# EAGLE design Motor_Driver_v4 (EAGLE 7.2.0)
DATABASE: C:\EAGLE-7.2.0\ulp\bom-ex164
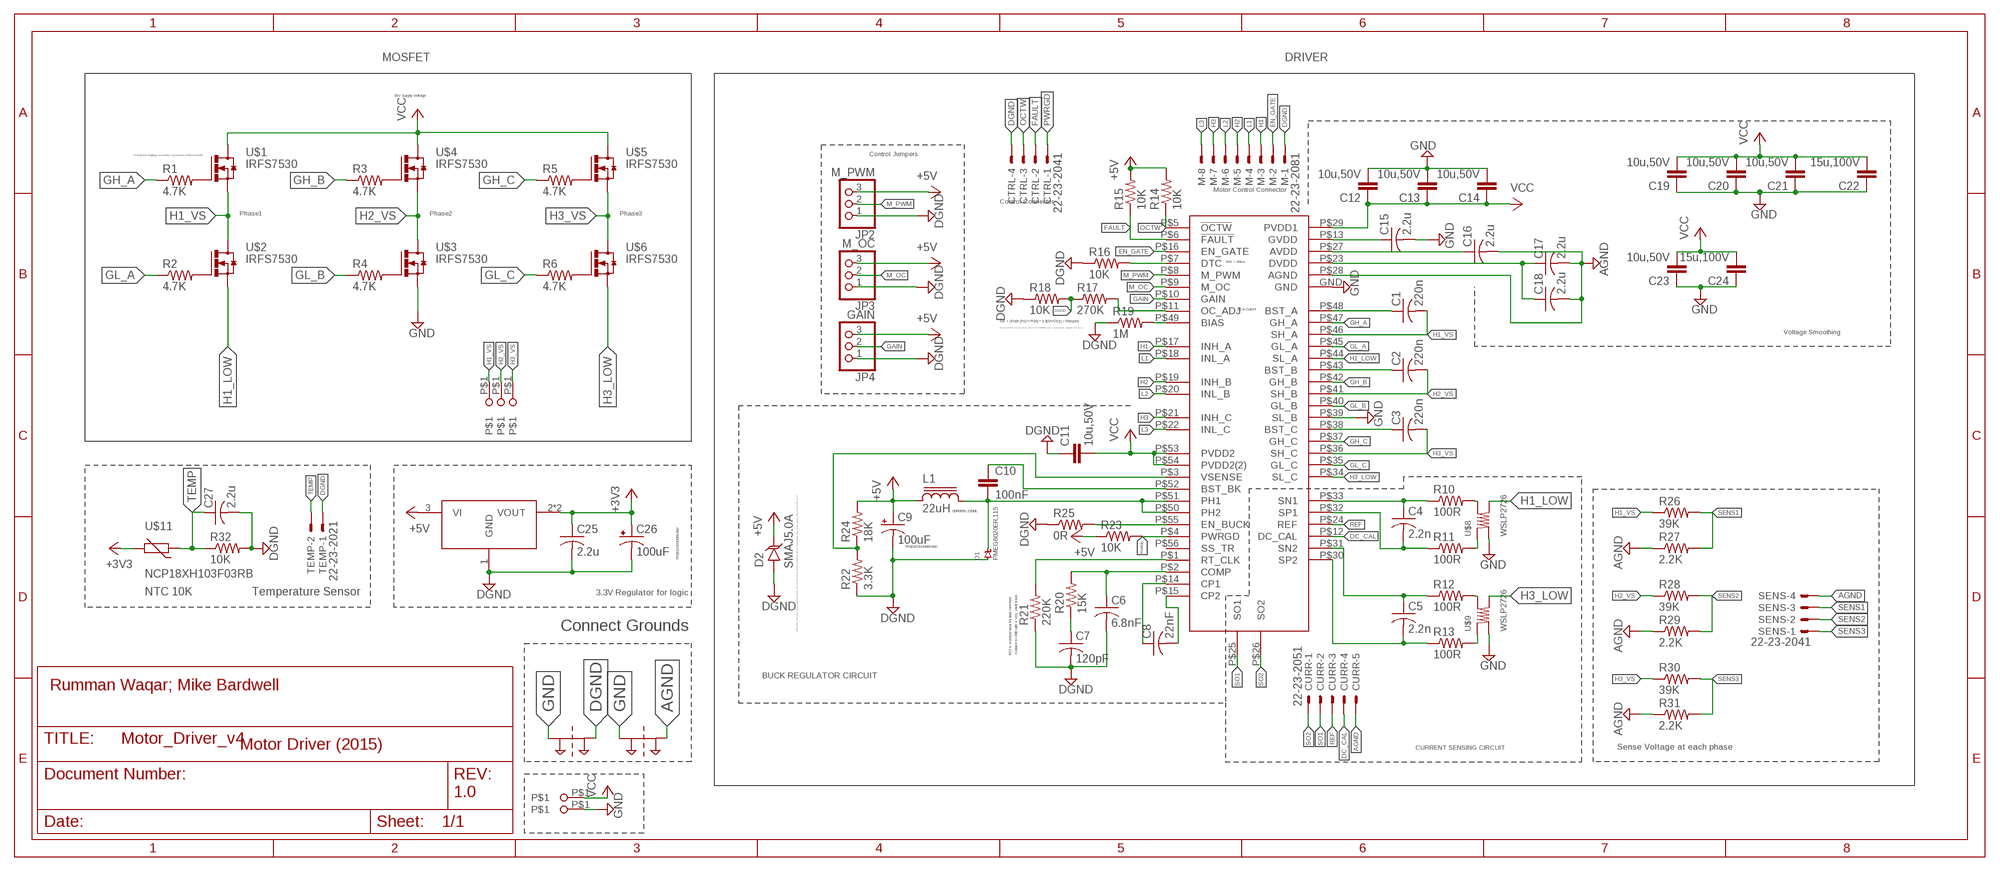
[diagram p0: schematic, sheet 1]

## Parts
C1  220n  C-USC0805  [C0805]
C2  220n  C-USC0805  [C0805]
C3  220n  C-USC0805  [C0805]
C4  2.2n  C-USC0603  [C0603]
C5  2.2n  C-USC0603  [C0603]
C6  6.8nF  C-USC0603  [C0603]
C7  120pF  C-USC0603  [C0603]
C8  22nF  C-USC0603  [C0603]
C9  100uF  CAP_POL3528-KIT  [EIA3528-KIT]
C10  100nF  CAP0805  [0805]
C11  10u,50V  CAP1206  [1206]
C12  10u,50V  CAP1206  [1206]
C13  10u,50V  CAP1206  [1206]
C14  10u,50V  CAP1206  [1206]
C15  2.2u  C-USC0805  [C0805]
C16  2.2u  C-USC0805  [C0805]
C17  2.2u  C-USC0805  [C0805]
C18  2.2u  C-USC0805  [C0805]
C19  10u,50V  CAP1206  [1206]
C20  10u,50V  CAP1206  [1206]
C21  10u,50V  CAP1206  [1206]
C22  15u,100V  C-EUC2220K  [C2220K]
C23  10u,50V  CAP1206  [1206]
C24  15u,100V  C-EUC2220K  [C2220K]
C25  2.2u  C-USC0805  [C0805]
C26  100uF  CAP_POL3528-KIT  [EIA3528-KIT]
C27  2.2u  C-USC0805  [C0805]
CTRL  22-23-2041  [22-23-2041]
CURR  22-23-2051  [22-23-2051]
D1  PMEG6020ER,115  DIODE[SCHOTKY]-SOD123W  [SOD123W]
D2  SMAJ5.0A  TVSSMA  [SMA-DIODE]
JP2  M_PWM  PINHD-1X3  [1X03]
JP3  M_OC  PINHD-1X3  [1X03]
JP4  GAIN  PINHD-1X3  [1X03]
L1  22uH  SDR0805  [SDR0805]
M  22-23-2081  [22-23-2081]
PT1  2PT_GND_TIE  [2PT_GND_TIE]
PT2  2PT_GND_TIE  [2PT_GND_TIE]
R1  4.7K  R-US_R0603  [R0603]
R2  4.7K  R-US_R0603  [R0603]
R3  4.7K  R-US_R0603  [R0603]
R4  4.7K  R-US_R0603  [R0603]
R5  4.7K  R-US_R0603  [R0603]
R6  4.7K  R-US_R0603  [R0603]
R10  100R  R-US_R0603  [R0603]
R11  100R  R-US_R0603  [R0603]
R12  100R  R-US_R0603  [R0603]
R13  100R  R-US_R0603  [R0603]
R14  10K  R-US_R0603  [R0603]
R15  10K  R-US_R0603  [R0603]
R16  10K  R-US_R0603  [R0603]
R17  270K  R-US_R0603  [R0603]
R18  10K  R-US_R0603  [R0603]
R19  1M  R-US_R0603  [R0603]
R20  15K  R-US_R0603  [R0603]
R21  220K  R-US_R0603  [R0603]
R22  3.3K  R-US_R0603  [R0603]
R23  10K  R-US_R0603  [R0603]
R24  18K  R-US_R0603  [R0603]
R25  0R  R-US_R0603  [R0603]
R26  39K  R-US_R0805  [R0805]
R27  2.2K  R-US_R0805  [R0805]
R28  39K  R-US_R0805  [R0805]
R29  2.2K  R-US_R0805  [R0805]
R30  39K  R-US_R0805  [R0805]
R31  2.2K  R-US_R0805  [R0805]
R32  10K  R-US_M0805  [M0805]
SENS  22-23-2041  [22-23-2041]
TEMP  22-23-2021  [22-23-2021]
U$1  IRFS7530  IRFS7530_HEATSINK  [IRF7530_HEATSINK]
U$2  IRFS7530  IRFS7530_HEATSINK  [IRF7530_HEATSINK]
U$3  IRFS7530  IRFS7530_HEATSINK  [IRF7530_HEATSINK]
U$4  IRFS7530  IRFS7530_HEATSINK  [IRF7530_HEATSINK]
U$5  IRFS7530  IRFS7530_HEATSINK  [IRF7530_HEATSINK]
U$6  IRFS7530  IRFS7530_HEATSINK  [IRF7530_HEATSINK]
U$7  DRV8302  [DRV8302]
U$8  WSLP2726  [WSLP2726]
U$9  WSLP2726  [WSLP2726]
U$10  TC2117  [SOT223]
U$11  NCP18XH103F03RB  [R0603]
U$12  1CONN_SOLDER  [1CONN_PAD]
U$13  1CONN_SOLDER  [1CONN_PAD]
U$14  1CONN_SOLDER  [1CONN_PAD]
U$15  1CONN_SOLDER  [1CONN_PAD]
U$16  1CONN_SOLDER  [1CONN_PAD]

## Nets
+3V3: C25.1 C26.A(+) U$10.2(VOUT) U$10.4(VOUT) U$11.2
+5V: C9.A(+) D2.C JP2.3 JP3.3 JP4.3 L1.1 R14.2 R15.2 R23.1 R24.2 U$10.3(VI)
AGND: C16.2 C17.2 C18.2 CURR.5 PT2.P$2 R27.1 R29.1 R31.1 SENS.4 U$7.P$28(AGND)
DC_CAL: CURR.4 U$7.P$12(DC_CAL)
DGND: C6.2 C7.2 C9.C(-) C11.1 C25.2 C26.C(-) C27.2 CTRL.4 D1.P$1 D2.A JP2.1 JP3.1 JP4.1 M.1 PT1.P$2 R16.1 R18.1 R19.1 R21.1 R22.1 R25.1 R32.2 TEMP.1 U$10.1(GND)
DVDD: R17.1 R18.2
EN_GATE: M.2 U$7.P$16(EN_GATE)
FAULT: CTRL.2 R15.1 U$7.P$6(!FAULT)
GAIN: JP4.2 U$7.P$10(GAIN)
GH_A: R1.1 U$7.P$47(GH_A)
GH_B: R3.1 U$7.P$42(GH_B)
GH_C: R5.1 U$7.P$37(GH_C)
GL_A: R2.1 U$7.P$45(GL_A)
GL_B: R4.1 U$7.P$40(GL_B)
GL_C: R6.1 U$7.P$35(GL_C)
GND: C12.2 C13.2 C14.2 C15.2 C19.1 C20.1 C21.1 C22.1 C23.1 C24.1 PT1.P$1 PT2.P$1 U$3.S1(S) U$3.S2(S) U$3.S3(S) U$3.S4(S) U$3.S5(S) U$7.GND U$7.P$39(SL_B) U$8.P$2 U$9.P$2 U$16.P$1
H1: M.3 U$7.P$17(INH_A)
H1_LOW: U$2.S1(S) U$2.S2(S) U$2.S3(S) U$2.S4(S) U$2.S5(S) U$7.P$44(SL_A) U$8.P$1
H1_VS: C1.2 R26.1 U$1.S1(S) U$1.S2(S) U$1.S3(S) U$1.S4(S) U$1.S5(S) U$2.D1(D) U$7.P$46(SH_A) U$14.P$1
H2: M.5 U$7.P$19(INH_B)
H2_VS: C2.2 R28.1 U$3.D1(D) U$4.S1(S) U$4.S2(S) U$4.S3(S) U$4.S4(S) U$4.S5(S) U$7.P$41(SH_B) U$13.P$1
H3: M.7 U$7.P$21(INH_C)
H3_LOW: U$6.S1(S) U$6.S2(S) U$6.S3(S) U$6.S4(S) U$6.S5(S) U$7.P$34(SL_C) U$9.P$1
H3_VS: C3.2 R30.1 U$5.S1(S) U$5.S2(S) U$5.S3(S) U$5.S4(S) U$5.S5(S) U$6.D1(D) U$7.P$36(SH_C) U$12.P$1
L1: M.4 U$7.P$18(INL_A)
L2: M.6 U$7.P$20(INL_B)
L3: M.8 U$7.P$22(INL_C)
M_OC: JP3.2 U$7.P$9(M_OC)
M_PWM: JP2.2 U$7.P$8(M_PWM)
N$1: R1.2 U$1.G1(G)
N$2: R2.2 U$2.G1(G)
N$3: R4.2 U$3.G1(G)
N$4: R3.2 U$4.G1(G)
N$5: R5.2 U$5.G1(G)
N$6: R6.2 U$6.G1(G)
N$7: C1.1 U$7.P$48(BST_A)
N$8: R17.2 U$7.P$11(OC_ADJ)
N$10: C8.1 U$7.P$14(CP1)
N$11: C5.2 R13.1 U$7.P$30(SP2)
N$12: C2.1 U$7.P$43(BST_B)
N$13: C8.2 U$7.P$15(CP2)
N$14: C7.1 R20.1
N$15: R21.2 U$7.P$1(RT_CLK)
N$16: R16.2 U$7.P$7(DTC)
N$17: R25.2 U$7.P$55(EN_BUCK)
N$18: C15.1 U$7.P$13(GVDD)
N$19: C10.2 D1.P$2 L1.2 U$7.P$50(PH2) U$7.P$51(PH1)
N$20: C6.1 R20.2 U$7.P$2(COMP)
N$21: R19.2 U$7.P$49(BIAS)
N$22: C4.1 R10.1 U$7.P$33(SN1)
N$23: C4.2 R11.1 U$7.P$32(SP1)
N$24: C5.1 R12.1 U$7.P$31(SN2)
N$26: C3.1 U$7.P$38(BST_C)
N$27: C16.1 U$7.P$27(AVDD)
N$28: R22.2 R24.1 U$7.P$3(VSENSE)
N$29: C10.1 U$7.P$52(BST_BK)
N$30: C17.1 C18.1 U$7.P$23(DVDD)
N$124: R12.2 U$9.P$3
N$126: R10.2 U$8.P$3
N$127: R11.2 U$8.P$4
N$128: R13.2 U$9.P$4
OCTW: CTRL.3 R14.1 U$7.P$5(!OCTW)
PWRGD: CTRL.1 R23.2 U$7.P$4(PWRGD)
REF: CURR.3 U$7.P$24(REF)
SENS1: R26.2 R27.2 SENS.3
SENS2: R28.2 R29.2 SENS.2
SENS3: R30.2 R31.2 SENS.1
SO1: CURR.2 U$7.P$25(SO1)
SO2: CURR.1 U$7.P$26(SO2)
TEMP: C27.1 R32.1 TEMP.2 U$11.1
VCC: C11.2 C12.1 C13.1 C14.1 C19.2 C20.2 C21.2 C22.2 C23.2 C24.2 U$1.D1(D) U$4.D1(D) U$5.D1(D) U$7.P$29(PVDD1) U$7.P$53(PVDD2) U$7.P$54(PVDD2(2)) U$15.P$1
Unconnected: U$7.P$56(SS_TR)

## Notes on the sheet
- MOSFET | DRIVER
- 36V Supply Voltage
- * Dampens ringing caused by capacitance of the mosfet | Control Jumpers
- Motor Control Connector
- Control Connector
- Phase1 | Phase2 | Phase3
- 10K = 80ns
- 90 A Cutoff
- Ioc = (R18/ (R17+R18) * 3.3[DVDD] ) / Rds(on)
- Don't mount R18, because internal current limit of DRV8302 doesn't work with this config for some reason
- Voltage Smoothing
- SDR0805-220ML
- TPSB107K006R0400
- TPSB107K006R0400
- NTC 10K | Temperature Sensor | 3.3V Regulator for logic
- Connect Grounds | A TVS diode, or transient voltage suppression diode, is an electrical device which is designed to divert or shunt voltage spikes from a circuit in order to protect that circuit.
- R21 is external clock for buck converter. | Connect to GND with a very short trace.
- BUCK REGULATOR CIRCUIT
- Rumman Waqar; Mike Bardwell
- Motor Driver (2015) | CURRENT SENSING CIRCUIT | Sense Voltage at each phase
- 1.0

## Library data of the parts
C1-C8 C15-C18 C25 C27 = adafruit:C-US: CAPACITOR, American symbol
C9 C26 = SparkFun-Capacitors:CAP_POL: Capacitor Polarized These are standard SMD and PTH capacitors. Normally 10uF, 47uF, and 100uF in electrolytic and tantalum varieties. Always verify the external diameter of the through hole cap, it varies with capacity, voltage, and manufacturer. The EIA devices should be standard.
C10-C14 C19-C21 C23 = SparkFun-Passives:CAP: Capacitor Standard 0603 ceramic capacitor, and 0.1" leaded capacitor.
C22 C24 = resistor:C-EU: CAPACITOR, European symbol
CTRL SENS = con-molex:22-23-2041: .100" (2.54mm) Center Header - 4 Pin; MF: MOLEX; MPN: 22-23-2041; OC_FARNELL: 1462920; OC_NEWARK: 38C0355
CURR = con-molex:22-23-2051: .100" (2.54mm) Center Header - 5 Pin; MF: MOLEX; MPN: 22-23-2051; OC_FARNELL: 1462952; OC_NEWARK: 38C9178
D1 = nxp:DIODE[SCHOTKY]
D2 = SparkFun-DiscreteSemi:TVS: Transient voltage suppressor- prevents ESD on inputs.
JP2-JP4 = pinhead:PINHD-1X3: PIN HEADER
L1 = bourne:SDR0805: POWER INDUCTOR
M = con-molex:22-23-2081: .100" (2.54mm) Center Header - 8 Pin; MF: MOLEX; MPN: 22-23-2081; OC_FARNELL: 1756826; OC_NEWARK: 01C7592
PT1 PT2 = SparkFun-Passives:2PT_GND_TIE: Package for connecting two ground nets in one place.
R1-R6 R10-R32 = adafruit:R-US_: RESISTOR, American symbol
TEMP = con-molex:22-23-2021: .100" (2.54mm) Center Header - 2 Pin; MF: MOLEX; MPN: 22-23-2021; OC_FARNELL: 1462926; OC_NEWARK: 25C3832
U$1-U$6 = bldc_lib:IRFS7530_HEATSINK: IRFS7530 with Heatsink
U$7 = bldc_lib:DRV8302: DRV8302 3-Phase Brushless Motor Pre-Driver with Dual Current Sense Amps and Buck Converter (PWM Ctrl)
U$8 U$9 = bldc_lib:WSLP2726: WSLP2726 Power Metal Strip® Resistors, Very High Power (to 7 W), Low Value (down to 0.0003 ), Surface Mount
U$10 = bldc_lib:TC2117
U$11 = bldc_lib:NCP18XH103F03RB: NTC Thermistor NTC Thermistors 10K OHM 1%
U$12-U$16 = bldc_lib:1CONN_SOLDER

## Board
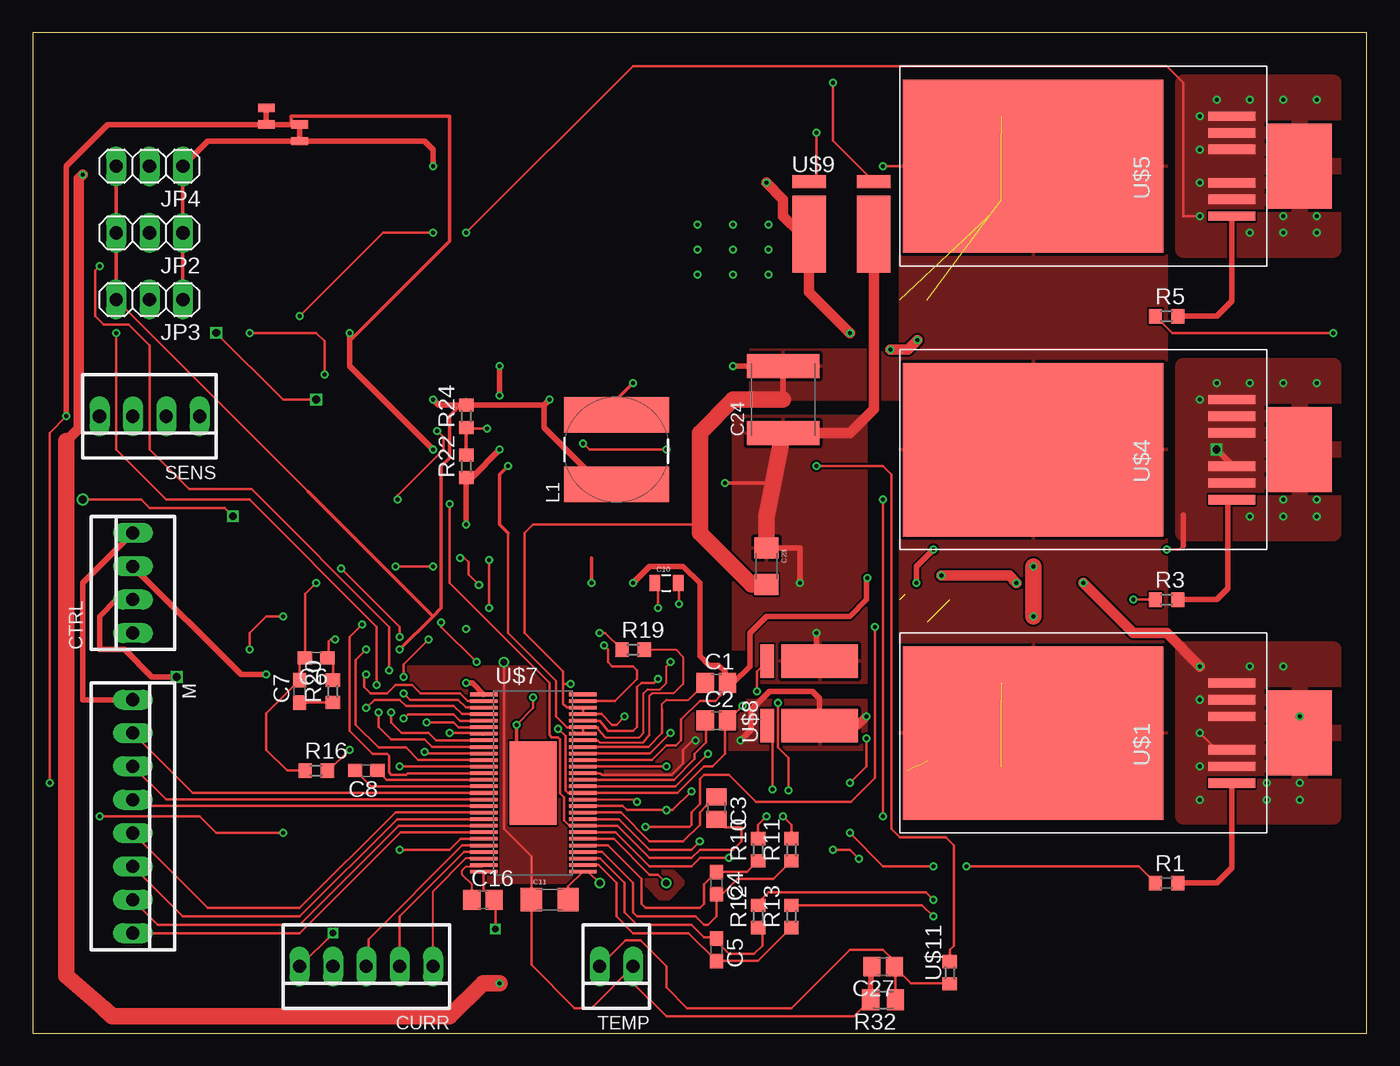
[diagram p1: board, top side]
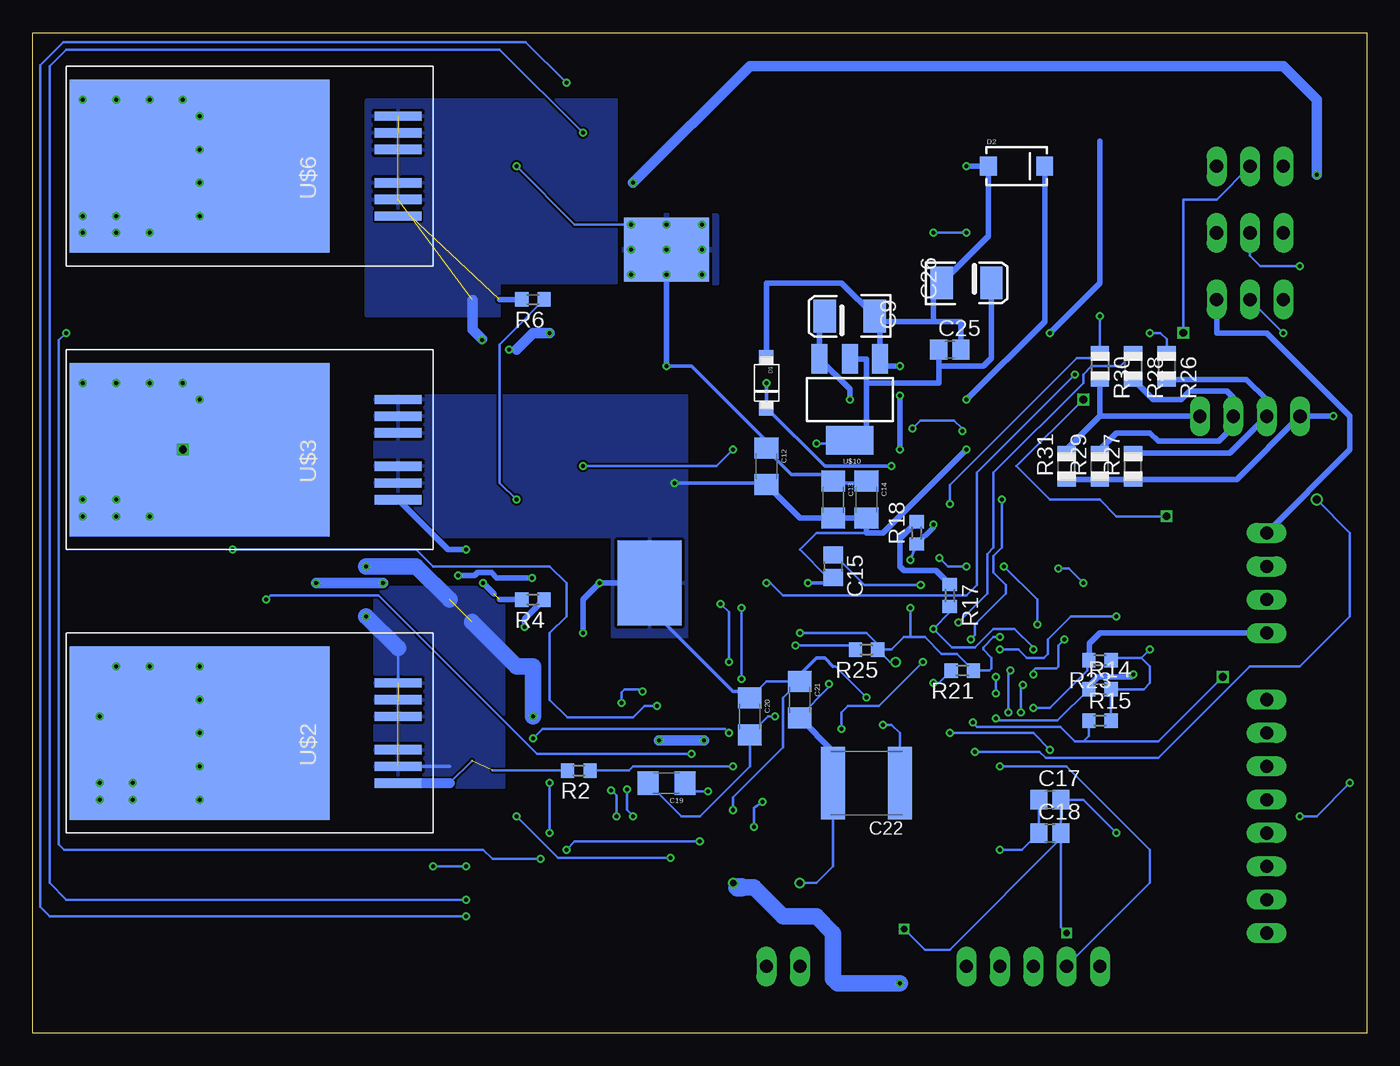
[diagram p2: board, bottom side, seen from below]

Size 101.6 x 76.2 mm. Coordinates in mm from the lower left corner, seen from the top.
Outline: 0,0 101.6,0 101.6,76.2 0,76.2 0,0
Copper layers (1*16): Top 0.035mm / dielectric 1.5mm / Bottom 0.035mm
Design rules "SeeedStudio_2layer_DRU_no_angle_20140221": minimum track width 6mil, minimum drill 12mil, track to track 6mil, track to pad 6mil, pad to pad 6mil, via to via 6mil, smd to smd 0mil, copper to edge 10mil, drill to drill 10mil, minimum pad ring 10mil, minimum via ring 6mil, stop-mask expansion 2mil, vias tented up to drill 100mil, thermal gap 10mil

### Footprints (pad centres in the part's own frame; a part is rotated, then mirrored left to right if it is on the bottom)
C0805 = smd 1.3 x 1.5: 1 -0.85,0; 2 0.85,0
C0603 = smd 1.1 x 1: 1 -0.85,0; 2 0.85,0
EIA3528-KIT = smd 1.7 x 2.5: A 1.9,0; C -1.9,0
0805 = smd 0.8 x 1.2: 1 -0.9,0; 2 0.9,0
1206 = smd 1.6 x 1.8: 1 -1.4,0; 2 1.4,0
C2220K = smd 1.85 x 5.5: 1 -2.55,0; 2 2.55,0
22-23-2041 = drill 1 long: 1 -3.81,0; 2 -1.27,0; 3 1.27,0; 4 3.81,0
22-23-2051 = drill 1 long: 1 -5.08,0; 2 -2.54,0; 3 0,0; 4 2.54,0; 5 5.08,0
SOD123W = smd 1.1 x 1.1: P$1 -1.95,0; P$2 1.95,0
SMA-DIODE = smd 1.27 x 1.47: A -2.15,0; C 2.15,0
1X03 = drill 1.016 long: 1 -2.54,0; 2 0,0; 3 2.54,0
SDR0805 = smd 2.7 x 8: 1 -2.65,0; 2 2.65,0
22-23-2081 = drill 1 long: 1 -8.89,0; 2 -6.35,0; 3 -3.81,0; 4 -1.27,0; 5 1.27,0; 6 3.81,0; 7 6.35,0; 8 8.89,0
2PT_GND_TIE = smd 1.27 x 0.635: P$1 0,0.635; P$2 0,-0.635
R0603 = smd 1 x 1.1: 1 -0.85,0; 2 0.85,0
R0805 = smd 1.1 x 1.4: 1 -1,0; 2 1,0
M0805 = smd 1.3 x 1.6: 1 -0.95,0; 2 0.95,0
22-23-2021 = drill 1 long: 1 -1.27,0; 2 1.27,0
IRF7530_HEATSINK = smd 13.208 x 19.812: D1 0,1.27 | smd 0.711 x 3.556: G1 -3.81,-13.856; S1 -2.54,-13.856; S2 -1.27,-13.856; S3 1.27,-13.856; S4 2.54,-13.856; S5 3.81,-13.856
DRV8302 = smd 3.61 x 6.35: GND 0,0 | smd 2.1 x 0.27: P$1 -3.75,6.75; P$2 -3.75,6.25; P$3 -3.75,5.75; P$4 -3.75,5.25; P$5 -3.75,4.75; P$6 -3.75,4.25; P$7 -3.75,3.75; P$8 -3.75,3.25; P$9 -3.75,2.75; P$10 -3.75,2.25; P$11 -3.75,1.75; P$12 -3.75,1.25; P$13 -3.75,0.75; P$14 -3.75,0.25; P$15 -3.75,-0.25; P$16 -3.75,-0.75; P$17 -3.75,-1.25; P$18 -3.75,-1.75; P$19 -3.75,-2.25; P$20 -3.75,-2.75; P$21 -3.75,-3.25; P$22 -3.75,-3.75; P$23 -3.75,-4.25; P$24 -3.75,-4.75; P$25 -3.75,-5.25; P$26 -3.75,-5.75; P$27 -3.75,-6.25; P$28 -3.75,-6.75; P$29 3.8,-6.75; P$30 3.8,-6.25; P$31 3.8,-5.75; P$32 3.8,-5.25; P$33 3.8,-4.75; P$34 3.8,-4.25; P$35 3.8,-3.75; P$36 3.8,-3.25; P$37 3.8,-2.75; P$38 3.8,-2.25; P$39 3.8,-1.75; P$40 3.8,-1.25; P$41 3.8,-0.75; P$42 3.8,-0.25; P$43 3.8,0.25; P$44 3.8,0.75; P$45 3.8,1.25; P$46 3.8,1.75; P$47 3.8,2.25; P$48 3.8,2.75; P$49 3.8,3.25; P$50 3.8,3.75; P$51 3.8,4.25; P$52 3.8,4.75; P$53 3.8,5.25; P$54 3.8,5.75; P$55 3.8,6.25; P$56 3.8,6.75
WSLP2726 = smd 2.54 x 5.842: P$1 -2.464,-0.889; P$2 2.464,-0.889 | smd 2.54 x 1.016: P$3 -2.464,3.111; P$4 2.464,3.111
SOT223 = smd 1.219 x 2.235: 1 -2.311,-3.099; 2 0,-3.099; 3 2.311,-3.099 | smd 3.6 x 2.2: 4 0,3.099
1CONN_PAD = smd 6.452 x 4.877: P$1 0,0

### Placement (x,y rotation side)
C1  52.07,26.67 0 top
C2  52.07,23.81 0 top
C3  52.07,17.14 270 top
C4  52.07,11.43 270 top
C5  52.07,6.35 270 top
C6  21.59,28.57 180 top
C7  20.32,26.04 90 top
C8  25.4,20 180 top
C9  39.37,54.61 180 bottom
C10  48.26,34.29 0 top
C11  39.37,10.16 0 top
C12  45.72,43.18 270 bottom
C13  40.64,40.64 270 bottom
C14  38.1,40.64 270 bottom
C15  40.64,35.56 270 bottom
C16  34.29,10.16 0 top
C17  24.13,17.78 0 bottom
C18  24.13,15.24 0 bottom
C19  53.34,19.05 180 bottom
C20  46.99,24.13 270 bottom
C21  43.18,25.4 270 bottom
C22  38.1,19.05 180 bottom
C23  55.88,35.56 270 top
C24  57.15,48.26 90 top
C25  31.75,52.07 0 bottom
C26  30.48,57.15 0 bottom
C27  64.77,5.08 180 top
CTRL  7.62,34.29 90 top
CURR  25.4,5.08 180 top
D1  45.72,49.53 270 bottom
D2  26.67,66.04 0 bottom
JP2  8.89,60.96 180 top
JP3  8.89,55.88 180 top
JP4  8.89,66.04 180 top
L1  44.45,44.45 90 top
M  7.62,16.51 270 top
PT1  20.32,68.58 0 top
PT2  17.78,69.85 0 top
R1  86.36,11.43 0 top
R2  60.01,20 180 bottom
R3  86.36,33.02 0 top
R4  63.5,33.02 180 bottom
R5  86.36,54.61 0 top
R6  63.5,55.88 180 bottom
R10  55.24,13.97 90 top
R11  57.78,13.97 90 top
R12  55.24,8.89 90 top
R13  57.78,8.89 90 top
R14  20.32,26.19 0 bottom
R15  20.32,23.81 0 bottom
R16  21.59,20 0 top
R17  31.75,33.34 270 bottom
R18  34.29,38.1 90 bottom
R19  45.72,29.21 0 top
R20  22.86,26.04 90 top
R21  30.8,27.62 180 bottom
R22  33.02,43.18 90 top
R23  20.32,28.42 180 bottom
R24  33.02,46.99 90 top
R25  38.1,29.21 180 bottom
R26  15.24,50.8 270 bottom
R27  17.78,43.18 90 bottom
R28  17.78,50.8 270 bottom
R29  20.32,43.18 90 bottom
R30  20.32,50.8 270 bottom
R31  22.86,43.18 90 bottom
R32  64.77,2.54 180 top
SENS  8.89,46.99 180 top
TEMP  44.45,5.08 180 top
U$1  77.47,22.86 90 top
U$2  87.63,22.86 90 bottom
U$3  87.63,44.45 90 bottom
U$4  77.47,44.45 90 top
U$5  77.47,66.04 90 top
U$6  87.63,66.04 90 bottom
U$7  38.1,19.05 0 top
U$8  59.05,25.88 90 top
U$9  61.59,61.75 0 top
U$10  39.37,48.26 180 bottom
U$11  69.85,4.6 90 top
U$12  96.52,66.04 90 top
U$13  96.52,44.45 90 top
U$14  96.52,22.86 90 top
U$15  53.34,59.69 0 bottom
U$16  54.61,34.29 270 bottom

### Tracks (layer width: path | path; a pad name or v marks a point on that pad's centre or on a via)
+3V3  (via drill 0.3 pad 0.3)
  Top 0.203: U$11.2 69.85,6.35 70.17,6.67 70.17,14.29 69.53,14.92 66.04,14.92 65.41,15.56 65.41,42.55 64.77,43.18 v59.69,43.18 | v48.26,44.45 42.39,44.45 v41.91,44.93
  Bottom 0.203: v59.69,43.18 49.53,43.18 v48.26,44.45 | v41.91,44.93 39.6,44.93 U$10.4
  Bottom 0.406: U$10.2 38.1,51.36 38.1,49.53 | 38.1,49.53 32.6,49.53 C25.1 32.6,50.8 29.21,50.8 28.58,51.43 C26.A | 38.66,44.45 39.01,44.81 | 39.01,44.81 U$10.4 | 38.1,49.53 38.1,45.72 39.01,44.81
+5V  (via drill 0.3, 0.3 pad 0.3)
  Top 0.203: 20.95,41.27 JP3.3 | v19.05,31.75 17.78,31.75 16.51,30.48 v16.51,29.21
  Top 0.254: JP3.3 JP2.3 JP4.3 | 30.48,31.75 31.11,32.38 31.11,43.18 31.75,43.81 31.75,46.99 33.02,48.26 R24.2 | 30.48,31.75 v27.94,29.21 | 20.95,41.27 30.48,31.75
  Top 0.406: v30.48,48.26 30.9,47.84 R24.2 38.95,47.84 | 38.95,47.84 v39.37,48.26 | 38.95,47.84 38.95,46.14 43.18,41.91 44.34,41.91 L1.1
  Bottom 0.203: R15.2 R14.2 16.99,26.19 16.51,26.67 16.51,27.94 17.14,28.57 | 17.14,28.57 19.31,28.57 R23.1 | v27.94,29.21 26.51,29.21 25.88,28.57 24.61,28.57 24.29,28.89 24.29,30 22.54,31.75 v19.05,31.75 | v16.51,29.21 17.14,28.57
  Bottom 0.406: C9.A 41.68,54.2 U$10.3 39.37,49.05 v39.37,48.26 | D2.C 24.52,54.22 v30.48,48.26
AGND  (via drill 0.3, 0.3 pad 0.3, 0.5)
  Top 0.203: U$7.P$28 34.35,10.95 C16.2 35.24,10.06 v35.24,7.94 | v19.05,15.24 13.97,15.24 12.7,16.51 v5.08,16.51 | v1.27,19.05 1.27,45.72 v2.54,46.99 | v22.86,7.62 CURR.5
  Top 0.406: v2.54,46.99 2.54,66.04 5.71,69.22 PT2.P$2
  Bottom 0.203: 23.28,14.82 C18.2 C17.2 21.59,17.78 v19.05,15.24 | 23.28,14.82 31.75,6.35 33.66,6.35 v35.24,7.94 | 23.28,14.82 23.28,8.04 v22.86,7.62 | v5.08,16.51 3.81,16.51 v1.27,19.05
  Bottom 0.406: R31.1 R29.1 R27.1 9.89,42.18 SENS.4 v2.54,46.99
DC_CAL  (via drill 0.3)
  Top 0.203: U$7.P$12 27.96,20.3 v27.94,20.32
  Bottom 0.203: v27.94,20.32 22.86,20.32 16.51,13.97 16.51,11.43 CURR.4
DGND  (via drill 0.3, 0.3 pad 0.3, 0.5)
  Top 0.203: v35.88,28.26 35.88,15.56 37.97,13.46 C11.1 37.97,5.21 41.27,1.91 42.55,1.91 TEMP.1 45.72,3.81 48.26,1.27 62.55,1.27 R32.2 | v34.77,32.38 v34.77,36.04 | R16.1 19.37,20 17.78,21.59 17.78,24.34 C7.2 20.32,28.16 C6.2 20.74,33.44 v21.59,34.29 | v27.94,30.16 27.94,30.96 v23.5,35.4 | v43.18,30.48 43.6,30.48 R19.1
  Top 0.254: JP4.1 JP2.1 JP3.1
  Top 0.406: JP4.1 13.34,67.94 PT1.P$2 29.84,67.94 30.48,67.31 v30.48,66.04 | M.1 3.81,25.4 3.81,34.29 CTRL.4 | v33.02,38.73 R22.1 33.44,42.33 v35.56,44.45 | v35.56,48.58 v35.56,50.8 | R32.2 63.82,3.71 C27.2
  Bottom 0.203: R25.1 36.2,29.21 35.24,30.16 34.77,30.16 | v35.88,28.26 36.3,28.26 R25.1 | v34.77,36.04 R18.1 | v34.77,32.38 34.77,30.16 | v27.94,30.16 28.42,30.16 29.21,29.37 29.21,29.21 28.57,28.57 28.57,27.78 28.73,27.62 R21.1 31.22,28.89 32.38,28.89 33.66,30.16 34.77,30.16 | v23.5,35.4 22.7,35.4 v21.59,34.29 | R25.1 37.25,29.63 38.1,30.48 v43.18,30.48
  Bottom 0.406: 37.06,54.2 U$10.1 36.5,50.8 v35.56,50.8 | 37.06,54.2 C9.C 40.01,57.15 45.72,57.15 D1.P$1 | 37.06,54.2 33.02,54.2 | 33.02,54.2 30.9,54.2 C25.2 | 33.02,54.2 33.02,57.15 C26.C 28.82,60.71 D2.A v30.48,66.04 | JP3.1 11.43,53.34 7.62,53.34 1.27,46.99 1.27,44.45 CTRL.4 | 34.29,37.47 R18.1 33.02,38.52 v33.02,38.73 | v35.56,44.45 v35.56,48.58
  pour Top: 24.13,27.94 43.18,27.94 43.18,11.43 24.13,11.43
DVDD
  Bottom 0.406: R18.2 35.56,37.68 35.56,35.56 35.24,35.24 32.8,35.24 R17.1
EN_GATE
  Top 0.203: U$7.P$16 12.18,18.3 M.2
FAULT  (via drill 0.3, 0.6)
  Top 0.203: U$7.P$6 32.42,23.3 32.07,23.65 v30,23.65
  Top 0.406: CTRL.2 6.35,33.02 5.08,31.75 5.08,29.21 6.99,29.21 9.05,27.15 v10.95,27.15
  Bottom 0.203: v10.95,27.15 15.88,22.23 21.59,22.23 | 21.59,22.23 22.23,22.23 23.34,23.34 29.69,23.34 v30,23.65 | R15.1 21.17,22.64 21.59,22.23
GAIN  (via drill 0.3, 0.6)
  Top 0.203: U$7.P$10 29.98,21.3 v29.84,21.43 | v3.81,40.64 8.26,40.64 8.89,40.01 14.61,40.01 v15.24,39.37 | v21.59,48.26 19.05,48.26 v13.97,53.34
  Bottom 0.203: v29.84,21.43 24.92,21.43 24.45,20.95 15.88,20.95 8.89,27.94 5.08,27.94 1.27,31.75 1.27,38.1 v3.81,40.64 | v15.24,39.37 19.05,39.37 20.32,40.64 24.13,40.64 26.67,43.18 v21.59,48.26 | v13.97,53.34 13.97,63.5 11.43,63.5 JP4.2
GH_A  (via drill 0.3, 0.3 pad 0.3)
  Top 0.203: U$7.P$47 47.02,21.3 v48.58,22.86 | v63.5,22.46 63.5,20.32 v62.23,19.05 | v62.23,15.24 64.77,12.7 v68.58,12.7 | v71.12,12.7 84.24,12.7 R1.1
  Bottom 0.203: v62.23,19.05 v62.23,15.24 | v68.58,12.7 v71.12,12.7 | v48.58,22.86 48.9,23.18 62.79,23.18 v63.5,22.46
GH_B  (via drill 0.3)
  Top 0.203: U$7.P$42 48.96,18.8 v51.44,21.27 | v83.82,33.02 R3.1
  Bottom 0.203: v51.44,21.27 63.18,21.27 75.25,33.34 83.5,33.34 v83.82,33.02
GH_C  (via drill 0.3, 0.3 pad 0.3)
  Top 0.203: 85.72,54.4 R5.1 86.78,53.34 v99.06,53.34 | U$7.P$37 44.66,16.3 46.99,13.97 50.16,13.97 v50.8,14.61 | v60.96,13.97 62.23,13.97 v62.94,13.26
  Bottom 0.203: v50.8,14.61 60.33,14.61 v60.96,13.97 | v62.94,13.26 66.6,13.26 67.31,13.97 99.22,13.97 99.62,14.37 99.62,52.78 v99.06,53.34
GL_A  (via drill 0.3)
  Top 0.203: v48.26,20.32 41.92,20.32 U$7.P$45
  Bottom 0.203: R2.1 56.2,20 55.88,20.32 v48.26,20.32
GL_B  (via drill 0.3, 0.3 pad 0.3)
  Top 0.203: v46.04,17.62 46.04,17.78 U$7.P$40 | v46.67,15.72 50.01,15.72 50.16,15.88 50.16,16.83 50.8,17.46 50.8,19.37 51.12,19.68 53.02,19.68 55.09,17.62 62.31,17.62 64.14,19.45 v64.14,30.96
  Bottom 0.203: 62.87,32.8 R4.1 | v46.67,15.72 46.67,17.14 v46.04,17.62
  Bottom 0.406: v64.14,30.96 64.14,31.54 R4.1
GL_C  (via drill 0.3)
  Top 0.203: U$7.P$35 44.39,15.3 46.99,12.7 50.16,12.7 50.8,13.34 v53.02,13.34 | v64.77,16.51 v64.77,40.64
  Bottom 0.203: v53.02,13.34 61.59,13.34 v64.77,16.51 | R6.1 64.77,53.76 64.77,53.74 66.04,52.47 66.04,41.91 v64.77,40.64
GND  (via drill 0.3, 0.3 pad 0.3)
  Top 0.203: v50.16,18.41 48.74,16.99 v48.26,16.99 45.24,16.99 44.93,17.3 44.77,17.3 U$7.P$39 | v38.1,25.56 38.1,24.77 v36.83,23.5
  Top 0.254: U$7.GND 36.83,20.32 v36.83,23.5 | 19.68,69.22 19.68,69.85 31.75,69.85 31.75,60.33 24.13,52.7 | v42.55,34.29 42.55,36.2 | v52.7,41.91 55.88,41.91 56.37,41.81
  Top 0.406: 17.78,69.22 19.68,69.22 PT1.P$1 20.32,68.58 | v24.13,53.34 24.13,52.7 24.13,50.8 v30.48,44.45 | C23.1 58.42,36.96 v58.42,34.29 | v59.69,30.48 59.69,28.59 U$8.P$2
  Top 0.813: U$9.P$2 64.06,47.55 62.23,45.72 C24.1
  Top 1.27: C23.1 55.88,39.36 56.37,41.81 C24.1
  Bottom 0.203: C20.1 45.72,26.8 C21.1 44.45,25.53 44.45,21.75 48.26,17.94 v48.26,16.99 | v36.83,23.5 36.2,23.5 35.56,22.86 C22.1 | v50.16,18.41 51.3,18.41 C19.1 | 40.64,27.94 40.48,27.94 v38.1,25.56 | 38.1,38.1 41.91,38.1 43.18,36.83 41.06,34.71 C15.2
  Bottom 0.254: 56.52,34.29 48.26,26.04 46.99,26.04 C20.1 | 40.64,27.94 41.27,28.57 41.91,28.57 43.18,27.3 C21.1 | C22.1 | v42.55,34.29 40.64,34.29 C15.2 | v52.7,41.91 45.72,41.91 C12.2
  Bottom 0.406: C12.2 43.18,39.24 C13.2 C14.2 38.1,38.1 36.83,38.1 v30.48,44.45 | 20.32,67.94 20.32,57.15 v24.13,53.34 | U$16.P$1 56.52,34.29 v58.42,34.29 59.69,33.02 v59.69,30.48
  pour Bottom: 75.56,48.58 75.56,37.78 57.47,37.78 57.47,30.16 51.75,30.16 51.75,48.58
  pour Top: 54.61,26.67 54.61,29.21 53.34,29.21 53.34,46.99 63.5,46.99 63.5,26.67
H1
  Top 0.203: U$7.P$17 10.14,17.8 M.3
H1_LOW  (via drill 0.3 pad 0.3)  (5 unrouted)
  Top 0.203: U$7.P$44 43.22,19.8 43.34,19.68 48.66,19.68 49.53,20.56 49.53,21.59 50.24,22.3 v50.48,22.3 | U$8.P$1 62.78,23.41
  Top 0.406: v53.9,22.3 54.69,23.1 54.69,24.61 56.12,26.04 59.37,26.04 59.93,25.48 59.93,23.43 U$8.P$1
  Top 0.635: 62.78,23.41 v63.5,24.13
  Top 1.27: v76.2,31.75 v76.2,35.56
  Bottom 0.203: U$2.S5 73.77,29.32 | 63.5,27.94 63.5,28.36
  Bottom 0.254: U$2.S1 69.85,20.32
  Bottom 0.813: v50.48,22.3 v53.9,22.3
  Bottom 1.27: 73.77,29.32 v76.2,31.75 | v76.2,35.56 72.39,35.56 69.85,33.02 | v63.5,24.13 63.5,27.94 64.77,27.94 68.16,31.33
  pour Bottom: 65.72,33.97 75.56,33.97 75.56,18.73 65.72,18.73
  pour Top: 63.5,25.4 46.99,25.4 43.58,20.4 43.58,17.86 48.26,17.78 52.07,21.59 63.5,21.59
H1_VS  (via drill 0.3, 0.3 pad 0.3)
  Top 0.203: U$7.P$46 47.15,20.8 48.26,21.91 48.97,21.91 49.37,22.3 49.37,23.89 50.8,25.32 51.99,25.32 52.39,25.72 52.39,26.14 C1.2 53.34,26.67 | U$1.S2 90.17,21.59 U$2.D1 | v22.23,50.16 22.23,52.7 21.59,53.34 v16.51,53.34 | 63.5,34.61 v63.58,34.69
  Top 0.406: v45.72,34.29 46.99,35.56 49.53,35.56 50.8,34.29 50.8,28.73 51.51,28.02 52.23,28.02 52.7,27.54 52.7,26.89 C1.2 | 53.34,26.67 54.61,27.94 54.61,30.48 55.88,31.75 62.23,31.75 63.5,33.02 63.5,34.61
  Top 0.813: v80.01,34.29 83.82,30.48 86.36,30.48 v88.9,27.94 | v69.22,34.85 74.37,34.85 v74.93,34.29
  Bottom 0.203: v22.23,50.16 29.69,42.7 29.69,34.13 30.48,33.34 44.45,33.34 45.4,34.29 v45.72,34.29 | v16.51,53.34 15.72,53.34 15.24,52.86 R26.1
  Bottom 0.254: 15.24,51.44 R26.1
  Bottom 0.406: v63.58,34.69 66.28,34.69 66.67,35.08 67.71,35.08 67.94,34.85 v69.22,34.85
  Bottom 0.813: v74.93,34.29 v80.01,34.29
  other vias: 92.71,27.94 95.25,27.94 96.52,24.13 88.9,25.4 88.9,22.86 88.9,20.32 88.9,17.78 93.98,19.05 93.98,17.78 96.52,17.78 96.52,19.05
  pour Top: 87.63,29.21 99.06,29.21 99.06,16.51 87.63,16.51
H2
  Top 0.203: U$7.P$19 34.32,16.83 27.62,16.83 20.32,9.53 13.34,9.53 M.5
H2_VS  (via drill 0.3, 0.3 pad 0.3, 0.6)
  Top 0.203: v31.11,31.27 31.11,30.96 v33.81,28.26 | v40.01,23.18 40.56,22.62 40.56,18.49 40.76,18.3 U$7.P$41 49.1,18.3 51.12,20.32 51.75,20.32 52.7,21.27 52.7,23.6 C2.2 52.94,23.81 v54.05,24.92 | v86.36,36.83 87.31,36.83 87.63,37.15
  Top 0.406: 87.63,37.15 87.63,39.48 | U$4.S2 91.33,43.29 v90.17,44.45
  Bottom 0.203: v33.81,28.26 37.15,24.92 39.53,24.92 40.01,24.45 v40.01,23.18 | R28.1 18.78,50.8 20.95,50.8 21.59,50.16 21.59,49.53 28.42,42.7 28.42,36.99 28.89,36.51 28.89,33.5 v31.11,31.27 | v54.05,24.92 55.01,24.92 55.88,24.05 60.88,24.05 62.23,25.4 62.23,30.48 60.96,31.75 60.96,34.29 62.23,35.56 71.12,35.56 72.39,36.83 v86.36,36.83
  Bottom 0.406: v90.17,44.45 U$3.D1
  other vias: 97.79,49.53 95.25,49.53 92.71,49.53 90.17,49.53 88.9,48.26 92.71,39.37 95.25,39.37 95.25,40.64 97.79,40.64 97.79,39.37
  pour Top: 87.63,50.8 99.06,50.8 99.06,38.1 87.63,38.1
H3
  Top 0.203: U$7.P$21 27.86,15.8 20.32,8.26 9.53,8.26 M.7
H3_LOW  (via drill 0.3, 0.3 pad 0.3, 0.5)  (5 unrouted)
  Top 0.203: U$7.P$34 44.26,14.8 46.99,12.06 47.62,12.06 v48.26,11.43 | 58.42,60.96 59.04,60.96 U$9.P$1
  Top 0.813: v55.88,64.77 57.15,63.5 57.15,62.23 58.42,60.96 | U$9.P$1 59.13,56.44 v62.23,53.34 | v65.33,52.07 66.67,52.07 v67.39,52.78 | 2.54,45.09 3.49,46.04 3.49,65.09 v3.81,65.41
  Top 1.27: 2.54,45.09 2.54,4.37 5.4,1.91 6.03,1.27 31.75,1.27 34.29,3.81 v35.56,3.81
  Bottom 0.203: 47.94,11.11 v48.26,11.43 | 64.77,52.07 v65.33,52.07 | v67.39,52.78 67.39,52.86
  Bottom 0.254: 73.66,69.85 U$6.S5
  Bottom 0.813: v3.81,65.41 3.81,71.12 6.35,73.66 46.99,73.66 v55.88,64.77 | v62.23,53.34 63.5,53.34 64.77,52.07 | 67.39,52.86 68.1,53.58 68.1,55.82
  Bottom 1.27: v35.56,3.81 40.32,3.81 40.64,4.13 40.64,7.62 41.91,8.89 44.45,8.89 46.67,11.11 47.62,11.11
  Bottom 1.397: 47.62,11.11 47.94,11.11
  pour Bottom: 72.07,70.48 75.88,70.48 75.88,63.18 72.07,63.18
  pour Bottom: 76.2,71.12 57.15,71.12 57.15,57.15 66.04,57.15 66.04,54.61 76.2,54.61
H3_VS  (via drill 0.3, 0.3 pad 0.3)
  Top 0.152: U$7.P$36 40.87,15.8 40.48,16.19
  Top 0.203: U$7.P$36 44.52,15.8 46.99,13.34 50.16,13.34 50.8,13.97 53.34,13.97 53.98,14.61 53.98,15.66 52.7,15.66 C3.2 | v31.75,40.32 31.75,34.29 39.37,26.67 39.37,22.7 39.53,22.54 40.01,22.54 40.16,22.38 40.16,18.26 40.48,17.94 40.48,16.19 | v88.9,62.23 87.63,62.23 87.63,72.39 86.36,73.66 45.72,73.66 v33.02,60.96 | v30.48,60.96 26.67,60.96 v20.32,54.61
  Bottom 0.203: v31.75,40.32 31.75,41.75 22.07,51.44 20.68,51.44 R30.1 v20.32,54.61 | v33.02,60.96 v30.48,60.96
  Bottom 0.406: v88.9,64.77 U$6.D1
  other vias: 97.79,71.12 95.25,71.12 92.71,71.12 90.17,71.12 88.9,69.85 88.9,67.31 92.71,60.96 95.25,60.96 95.25,62.23 97.79,60.96 97.79,62.23
  pour Top: 87.63,72.39 99.06,72.39 99.06,59.69 87.63,59.69
L1
  Top 0.203: U$7.P$18 8.1,17.3 M.4
L2
  Top 0.203: U$7.P$20 27.73,16.3 20.32,8.89 11.43,8.89 M.6
L3
  Top 0.203: U$7.P$22 28,15.3 20.32,7.62 M.8
M_OC  (via drill 0.3, 0.3 pad 0.3)
  Top 0.203: U$7.P$9 30.43,21.8 29.84,22.38 27.3,22.38 26.35,23.34 v26.35,24.45 | v26.19,26.51 26.19,30.96 16.51,40.64 10.16,40.64 6.35,44.45 v6.35,53.34
  Bottom 0.203: v26.35,24.45 26.35,26.35 v26.19,26.51 | v6.35,53.34 JP3.2
M_PWM  (via drill 0.3, 0.3 pad 0.3)
  Top 0.203: U$7.P$8 30.72,22.3 30.16,22.86 28.1,22.86 27.3,23.65 v27.3,24.45 | v27.15,27.62 27.15,30.96 16.67,41.43 11.91,41.43 8.89,44.45 8.89,52.39 7.3,53.98 5.4,53.98 4.76,54.61 4.76,58.1 v5.08,58.42
  Bottom 0.203: v27.3,24.45 27.3,27.46 v27.15,27.62 | v5.08,58.42 8.1,58.42 8.89,59.21 JP2.2
N$1
  Top 0.203: 87.52,11.74 R1.2
  Top 0.406: U$1.G1 91.33,12.59 90.17,11.43 R1.2
N$2  (1 unrouted)
  Bottom 0.203: 68.16,20.74 69.85,19.05 | R2.2 66.57,20
  Bottom 0.762: U$2.G1 69.85,19.05
N$3  (via drill 0.3 pad 0.3)  (1 unrouted)
  Top 0.406: v67.31,34.29 67.31,35.56 v68.58,36.83
  Bottom 0.406: R4.2 66.04,33.02 | 66.46,33.44 v67.31,34.29 | v68.58,36.83 69.96,36.83 U$3.G1
N$4
  Top 0.406: U$4.G1 91.02,40.33 91.02,33.87 90.17,33.02 R3.2
N$5
  Top 0.406: 87.52,54.92 R5.2 90.17,54.61 91.33,55.77 U$5.G1
N$6  (1 unrouted)
  Bottom 0.406: R6.2 66.04,55.88 | U$6.G1 72.81,62.23
N$7
  Top 0.152: 47.94,24.66 47.94,25.08 48.26,25.4 49.95,25.4 C1.1
  Top 0.203: U$7.P$48 46.88,21.8 47.94,22.86 47.94,24.66
N$8  (via drill 0.3, 0.3 pad 0.3)
  Top 0.203: U$7.P$11 29.36,20.8 28.42,21.75 26.35,21.75 24.61,23.5 24.61,28.42 v25.4,29.21
  Bottom 0.203: v25.4,29.21 25.4,29.37 26.83,30.8 28.42,30.8 29.84,29.37 31.59,29.37 v33.02,30.8 | 32.86,30.64 v33.02,30.8 | v33.02,30.8 33.02,30.9 | R17.2 31.75,32.07 v33.02,30.8
N$9
  pour Top: 49.53,11.43 45.72,15.24 43.97,15.24 43.97,14.29 47.78,10.32 48.42,10.32
N$10
  Top 0.203: U$7.P$14 26.95,19.3 C8.1
N$11
  Top 0.203: U$7.P$30 43.08,12.8 44.45,11.43 44.45,8.89 45.72,7.62 49.95,7.62 C5.2 55.24,5.5 R13.1
N$12
  Top 0.203: U$7.P$43 48.83,19.3 50.4,20.88 50.4,21.27 51.28,22.15 51.28,23.76 C2.1
N$13
  Top 0.203: U$7.P$15 25.75,18.8 C8.2
N$14
  Top 0.203: R20.1 C7.1
N$15  (via drill 0.3)
  Top 0.406: v33.02,26.67 33.48,26.67 U$7.P$1
  Bottom 0.203: v33.02,26.67 32.6,26.67 R21.2
N$16  (via drill 0.3 pad 0.3)
  Top 0.203: R16.2 22.54,20 v24.13,21.59 | 34.25,22.7 U$7.P$7 34.29,22.86 v31.75,22.86
  Bottom 0.203: v24.13,21.59 25.4,22.86 v31.75,22.86
N$17  (via drill 0.3)
  Top 0.203: U$7.P$55 44.35,25.3 46.04,26.99 46.04,27.62 45.72,27.94 44.13,27.94 43.81,28.26 43.81,29.21 v43.5,29.53
  Bottom 0.203: v43.5,29.53 39.27,29.53 R25.2
N$18  (via drill 0.3, 0.3 pad 0.3)
  Top 0.203: U$7.P$13 28.53,19.8 28.42,19.68 27.3,19.68 27.15,19.84 27.15,21.11 26.99,21.27 25.88,21.27 24.13,23.02 24.13,30.16 v25.08,31.11 24.92,30.96 | v27.62,35.56 v30.48,35.56 | v32.54,36.2 32.86,36.2 33.18,35.88 33.18,34.92 v33.97,34.13
  Bottom 0.203: v25.08,31.11 25.08,33.02 v27.62,35.56 | v30.48,35.56 31.91,35.56 v32.54,36.2 | v33.97,34.13 38.26,34.13 40.54,36.41 C15.1
N$19  (via drill 0.3)
  Top 0.152: 43.06,23.3 43.06,23.14 43.58,22.54 46.2,22.54 46.51,22.86 46.51,25.88 46.83,26.19 47.78,26.19 48.26,26.67 48.26,27.94 v48.58,28.26 | U$7.P$51 40.84,23.3
  Top 0.203: U$7.P$50 U$7.P$51 43.06,23.3 | v49.21,32.7 49.21,34.24 C10.2 | 36.2,38.1 36.2,30.48 39.85,26.83 39.85,24.13 40.68,23.3 40.84,23.3
  Top 0.254: v45.72,49.53 44.45,48.26 L1.2 | 36.2,38.1 35.56,38.73 35.56,42.55 v36.2,43.18 | 41.27,22.86 U$7.P$50
  Bottom 0.203: v48.58,28.26 48.58,32.07 v49.21,32.7
  Bottom 0.254: v45.72,49.53 45.72,47.62 | v36.2,43.18 41.27,43.18 45.72,47.62 | 45.72,47.62 D1.P$2
N$20  (via drill 0.3 pad 0.3)
  Top 0.203: U$7.P$2 33.12,25.3 32.54,25.88 29.53,25.88 28.89,26.51 27.62,26.51 26.99,25.88 25.72,25.88 25.24,26.35 25.24,27.15 v25.4,27.3 | v23.02,30 22.7,30 22.54,29.84 22.54,28.68 C6.1 22.86,28.16 R20.2
  Bottom 0.203: v25.4,27.3 25.4,27.62 25.24,27.78 23.65,27.78 23.5,27.94 23.5,29.53 v23.02,30
N$21
  Top 0.152: U$7.P$49 43.03,22.3 43.18,22.15 46.51,22.15 46.99,22.7 46.99,25.72 47.15,25.88 48.82,25.88 49.53,26.59 49.53,28.65 48.97,29.21 R19.2
N$22
  Top 0.203: U$7.P$33 43.8,14.3 46.35,11.75 46.35,9.84 46.67,9.53 50.8,9.53 51.12,9.84 51.12,11.33 C4.1 54.41,12.28 R10.1
N$23
  Top 0.203: U$7.P$32 43.35,13.8 45.72,11.43 45.72,9.21 46.04,8.89 50.48,8.89 51.12,8.26 51.44,8.26 52.07,8.89 C4.2 52.49,10.58 53.66,11.75 56.41,11.75 R11.1
N$24
  Top 0.203: U$7.P$31 43.22,13.3 45.09,11.43 45.09,9.21 46.04,8.26 50.16,8.26 51.12,7.3 51.97,7.3 C5.1 52.07,6.99 53.02,6.03 54.93,6.03 55.56,6.67 55.56,7.72 R12.1
N$26
  Top 0.203: U$7.P$38 44.8,16.8 46.99,14.61 49.53,14.61 50.8,15.88 50.8,16.83 51.28,17.3 51.38,17.3 C3.1
N$27
  Top 0.152: C16.1 33.44,11.33 32.7,12.06 32.7,12.38 33.02,12.7 34.25,12.7 U$7.P$27
N$28  (via drill 0.3 pad 0.3)
  Top 0.203: U$7.P$3 32.98,24.8 32.38,25.4 28.73,25.4 v28.26,25.88 | v30.8,45.88 31.27,45.4 31.27,44.45 27.78,40.96 v27.78,40.64 | v34.61,46.04 33.12,46.04 R24.1 | v28.26,27.15 28.26,28.1 v30.16,30
  Top 0.254: R24.1 R22.2
  Bottom 0.203: v28.26,25.88 v28.26,27.15 | v27.78,40.64 27.78,36.99 28.42,36.35 28.42,35.08 27.46,34.13 27.46,33.5 29.84,31.11 29.84,30.32 v30.16,30 | v30.8,45.88 30.8,46.04 31.43,46.67 33.97,46.67 v34.61,46.04
N$29  (via drill 0.3)
  Top 0.203: U$7.P$52 43.19,23.8 43.81,23.02 45.72,23.02 46.04,23.34 46.04,26.35 46.35,26.67 47.31,26.67 v47.62,26.99 | v47.62,32.38 47.62,34.02 C10.1
  Bottom 0.203: v47.62,26.99 v47.62,32.38
N$30  (via drill 0.3)
  Top 0.203: U$7.P$23 32.58,14.8 31.75,13.97 v27.94,13.97
  Bottom 0.203: v27.94,13.97 26.25,13.97 C18.1 C17.1
N$124  (via drill 0.3 pad 0.3)
  Top 0.203: R12.2 55.24,9.92 56.04,10.72 68.02,10.72 v68.58,10.16 | v59.69,68.58 59.69,65.42 U$9.P$3
  Bottom 0.203: v68.58,10.16 99.06,10.16 100.33,11.43 100.33,73.66 99.06,74.93 66.04,74.93 v59.69,68.58
N$126  (via drill 0.3 pad 0.3)
  Top 0.203: R10.2 55.24,15.88 v55.88,16.51 | v56.36,18.57 56.36,23 U$8.P$3
  Bottom 0.203: v55.88,16.51 56.36,16.99 v56.36,18.57
N$127  (via drill 0.3 pad 0.3)
  Top 0.203: R11.2 57.78,15.88 v57.15,16.51 | v57.55,18.49 57.55,20.95 56.75,21.75 v56.75,25.16 | v55.17,26.04 55.17,27.56 U$8.P$4
  Bottom 0.203: v57.15,16.51 57.15,18.1 v57.55,18.49 | v56.75,25.16 56.75,25.96 56.52,26.19 55.32,26.19 v55.17,26.04
N$128  (via drill 0.3 pad 0.3)
  Top 0.203: R13.2 67.73,9.74 v68.58,8.89 | v60.96,72.39 60.96,67.96 U$9.P$4
  Bottom 0.203: v68.58,8.89 100.33,8.89 101.04,9.6 101.04,73.74 99.3,75.49 64.06,75.49 v60.96,72.39
OCTW  (via drill 0.3 pad 0.3)
  Top 0.203: U$7.P$5 32.56,23.8 32.07,24.29 28.57,24.29 v28.26,23.97
  Top 0.406: v17.78,27.3 15.88,27.3 CTRL.3
  Bottom 0.203: R14.1 23.55,23.81 28.1,23.81 v28.26,23.97
  Bottom 0.406: R14.1 21.17,26.45 20.48,27.15 17.94,27.15 v17.78,27.3
PWRGD  (via drill 0.3 pad 0.3)
  Top 0.203: U$7.P$4 32.69,24.3 32.07,24.92 28.42,24.92 27.94,25.4 26.04,25.4 v25.4,24.77
  Bottom 0.203: v25.4,24.77 24.13,24.77 21.27,27.62 21.27,28.31 R23.2
  Bottom 0.406: CTRL.1 20.32,30.48 21.11,29.69 21.11,28.47 R23.2
REF
  Top 0.203: U$7.P$24 32.72,14.3 25.56,7.14 25.56,3.97 CURR.3
SENS1
  Bottom 0.406: R26.2 9.16,49.8 7.62,48.26 SENS.3 10.43,44.18 R27.2
SENS2
  Bottom 0.406: R29.2 20.32,44.45 19.05,45.72 16.51,45.72 15.88,45.09 11.27,45.09 10.16,46.2 SENS.2 10.16,48.42 10.64,48.9 13.49,48.9 14.13,48.26 16.24,48.26 R28.2
SENS3
  Bottom 0.406: R30.2 20.32,46.99 | 20.32,46.99 SENS.1 | R31.2 22.86,44.45 20.32,46.99
SO1
  Top 0.203: U$7.P$25 32.85,13.8 27.94,8.89 CURR.2
SO2
  Top 0.152: CURR.1 30.48,10.79 33.02,13.34 34.31,13.34 U$7.P$26
TEMP
  Top 0.203: 65.41,5.08 65.72,4.76 65.72,3.91 | 65.72,3.91 C27.1 | TEMP.2 45.16,7.06 46.28,7.06 48.26,5.08 48.26,3.49 49.85,1.91 57.78,1.91 62.23,6.35 64.77,6.35 65.62,5.5 C27.1 | 69.79,3.81 66.89,3.81 C27.1 | 65.72,3.91 R32.1
  Top 0.813: 69.79,3.81 U$11.1
VCC  (via drill 0.3, 0.3 pad 0.3, 0.5)
  Top 0.203: v45.09,24.13 44.45,23.5 44.13,23.5 43.33,24.3 U$7.P$53 U$7.P$54 40.68,24.8 40.4,25.08 40.4,26.67 | 50.8,38.73 38.1,38.73 37.47,38.1 37.47,30.48 40.4,27.54 40.4,26.67 | C11.2 40.77,11.17 U$7.P$29 42.31,12.3 v43.18,11.43 | v64.77,66.04 66.04,66.04 | v40.96,26.59 40.48,26.59 40.4,26.67
  Top 0.406: 57.15,48.26 C24.2 v53.34,50.8
  Top 1.27: U$5.D1 67.3,66.04 | C23.2 54.74,34.16 50.8,38.1 50.8,38.73 50.8,45.72 53.34,48.26 57.15,48.26
  Bottom 0.203: v45.09,24.13 45.59,24.13 C20.2 46.99,20.32 50.8,16.51 52.2,16.51 C19.2 | v43.18,11.43 41.91,11.43 40.64,12.7 C22.2 | v56.04,61.59 60.33,61.59 v64.77,66.04 | C21.2 43.18,24.13 40.96,26.35 v40.96,26.59
  Bottom 0.254: C14.1 38.1,41.91 40.64,41.91 C13.1 40.64,42.55 43.81,42.55 45.72,44.45 C12.1 45.72,45.09 51.44,50.8 v53.34,50.8
  Bottom 0.406: C22.2 40.65,21.47 C21.2 | U$15.P$1 v53.34,50.8 | v50.64,61.59 v50.64,59.69 v50.64,57.78 | v56.04,61.59 v56.04,59.69 v56.04,57.78
  other vias: 53.34,59.69 53.34,61.59 53.34,57.78
  pour Top: 66.04,72.39 86.36,72.39 86.36,16.51 66.04,16.51 66.04,48.26 54.61,48.26 54.61,52.07 66.04,52.07
  pour Bottom: 49.53,62.23 49.53,57.15 56.52,57.23 56.52,62.31